# Altium schematic sheet supply.SchDoc: Supply and battery charger
size A3; Author: Pietro Lorefice; Address3: Firenze; Address4: ITALY; Revision: 0; SheetNumber: 1; SheetTotal: 2; License: GPLv3
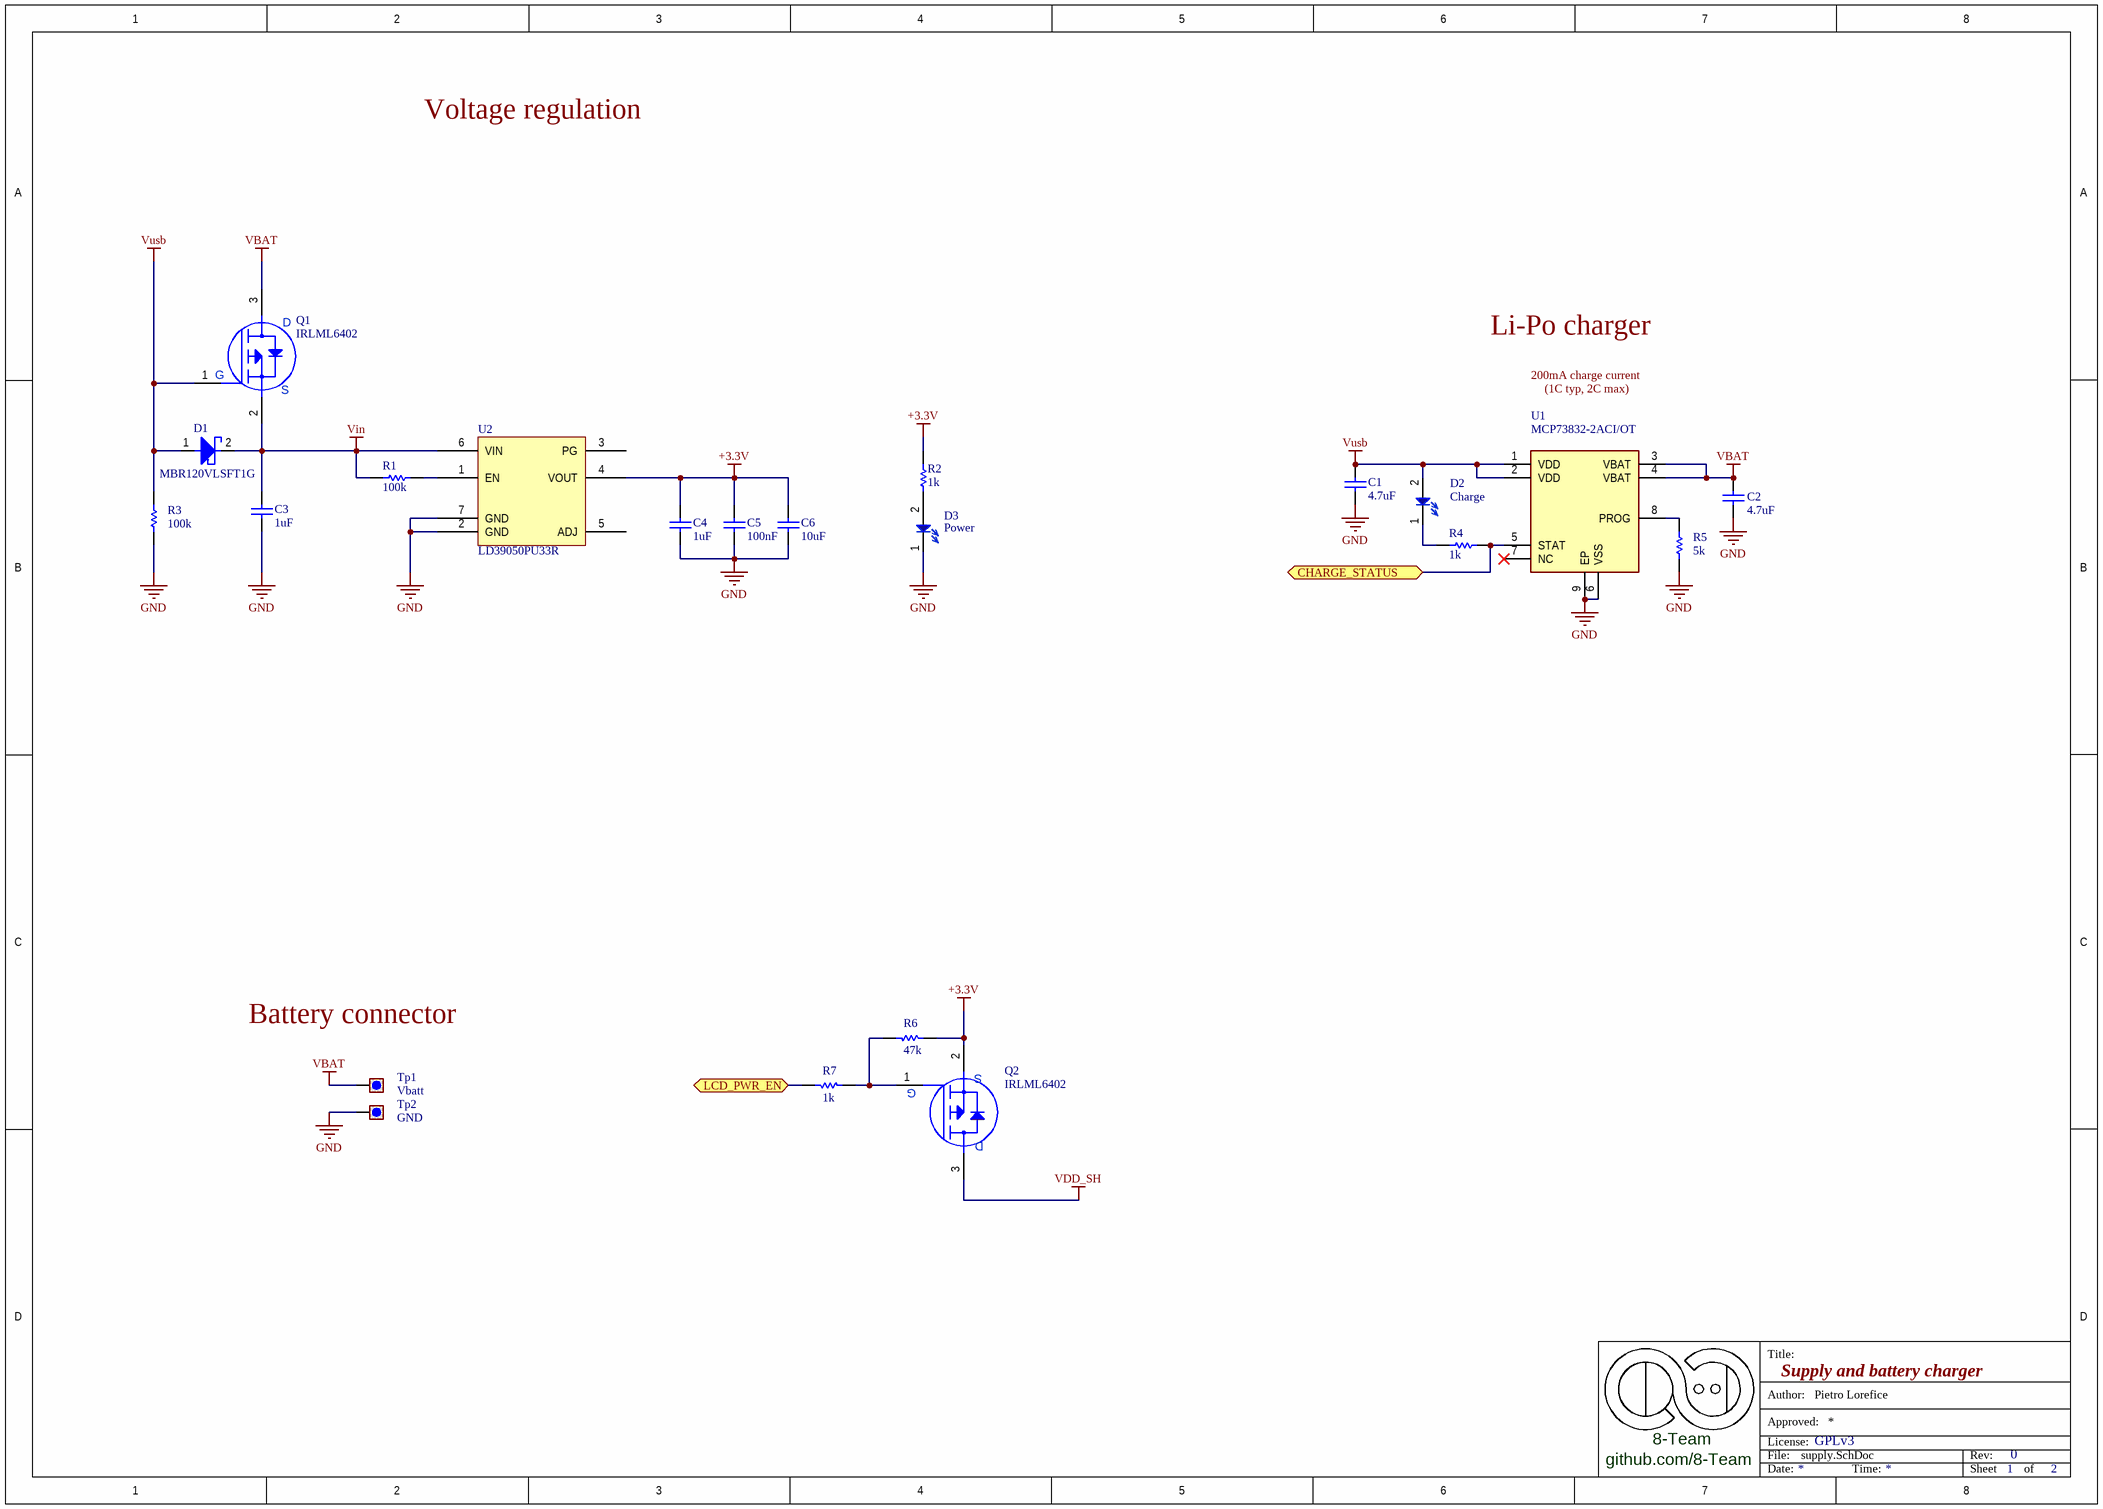
[diagram p0: supply.SchDoc]

## Parts
C1  4.7uF  [0603_[1608]]
C2  4.7uF  [0603_[1608]]
C3  1uF  [0603_[1608]]
C4  1uF  [0603_[1608]]
C5  100nF  [0402_[1005]]
C6  10uF  [0603_[1608]]
D1  MBR120VLSFT1G  [SOD-123]
D2  Charge  [0402_[1005]_K1-A2_LED]
D3  Power  [0402_[1005]_K1-A2_LED]
Q1  IRLML6402  [SOT-23]
Q2  IRLML6402  [SOT-23]
R1  100k  [0402_[1005]]
R2  1k  [0402_[1005]]
R3  100k  [0402_[1005]]
R4  1k  [0402_[1005]]
R5  5k  [0402_[1005]]
R6  47k  [0402_[1005]]
R7  1k  [0402_[1005]]
Tp1  Vbatt  [TEST_POINT_SMD_D1.6MM]  (no BOM)
Tp2  GND  [TEST_POINT_SMD_D1.6MM]  (no BOM)
U1  MCP73832-2ACI/OT  [PQFN50P200X300X100_HS-9N]
U2  LD39050PU33R  [DFN95P300X300X100_HS-7L]

## Ports
CHARGE_STATUS (bidir), LCD_PWR_EN (bidir)

## Nets
+3.3V: C4.2 C5.2 C6.2 Q2.2(S) R2.1 R6.1 U2.4(VOUT)
GND: C1.1 C2.1 C3.2 C4.1 C5.1 C6.1 D3.1(K) R3.1 R5.1 Tp2.1 U1.6(VSS) U1.9(EP) U2.2(GND) U2.7(GND)
VBAT: C2.2 Q1.3(D) Tp1.1 U1.3(VBAT) U1.4(VBAT)
VDD_SH: Q2.3(D)
Vin: C3.1 D1.2(K) Q1.2(S) R1.2 U2.6(VIN)
Vusb: C1.2 D1.1(A) D2.2(A) Q1.1(G) R3.2 U1.1(VDD) U1.2(VDD)
CHARGE_STATUS: R4.2 U1.5(STAT) ; port CHARGE_STATUS
LCD_PWR_EN: R7.2 ; port LCD_PWR_EN
NetD2_1: D2.1(K) R4.1
NetD3_2: D3.2(A) R2.2
NetQ2_1: Q2.1(G) R6.2 R7.1
NetR1_1: R1.1 U2.1(EN)
NetR5_2: R5.2 U1.8(PROG)

Not connected (* = marked no-connect by the designer): U1 7(NC)*; U2 3(PG) 5(ADJ)

## Notes on the sheet
- Voltage regulation
- Li-Po charger
- 200mA charge current
- (1C typ, 2C max)
- Battery connector
- Title:
- Author:
- 8-Team
- File:
- License:
- Approved:
- Rev:
- github.com/8-Team
- Date:
- Time:
- Sheet
- of

## Library data of the parts
C1-C4 C6 = Cap: Capacitor; Published: 8-Jun-2000; LatestRevisionDate: 17-Jul-2002; LatestRevisionNote: Re-released for DXP Platform.; PackageReference: RAD-0.3; Publisher: Altium Limited; PackageDescription: Radial Cap, Thru-Hole; 2 Leads; 0.3 in Pin Spacing
  C1 C2: Value: 4.7uF
  C3 C4: Value: 1uF
  C6: Value: 10uF
C5 = Cap: Capacitor; Value: 0.1uF; Published: 8-Jun-2000; LatestRevisionDate: 17-Jul-2002; LatestRevisionNote: Re-released for DXP Platform.; PackageReference: RAD-0.3; Publisher: Altium Limited; PackageDescription: Radial Cap, Thru-Hole; 2 Leads; 0.3 in Pin Spacing
D1 = Diode_SCHOTTKY: pin to pad: 1>2 2>1
D2 = LED_SMALL: Red
D3 = LED_SMALL: Green
Q1 Q2 = MOSFET-P 3pin
R1-R3 R7 = Res1: Resistor; Published: 8-Jun-2000; Publisher: Altium Limited
  R1 R3: LatestRevisionDate: 17-Jul-2002; LatestRevisionNote: Re-released for DXP Platform.; PackageReference: AXIAL-0.3; PackageDescription: Axial Device, Thru-Hole; 2 Leads; 0.3 in Pin Spacing; Value: 100K
  R2: LatestRevisionDate: 17-Jul-2002; LatestRevisionNote: Re-released for DXP Platform.; PackageReference: AXIAL-0.3; PackageDescription: Axial Device, Thru-Hole; 2 Leads; 0.3 in Pin Spacing; Value: 1K
  R7: Revision: July-2002: Re-released for DXP Platform.; Value: 1K
R4 = Res1: Resistor; Value: 470; Published: 8-Jun-2000; LatestRevisionDate: 17-Jul-2002; LatestRevisionNote: Re-released for DXP Platform.; PackageReference: AXIAL-0.3; Publisher: Altium Limited; PackageDescription: Axial Device, Thru-Hole; 2 Leads; 0.3 in Pin Spacing
R5 = Res1: Resistor; Value: 2K; Published: 8-Jun-2000; LatestRevisionDate: 17-Jul-2002; LatestRevisionNote: Re-released for DXP Platform.; PackageReference: AXIAL-0.3; Publisher: Altium Limited; PackageDescription: Axial Device, Thru-Hole; 2 Leads; 0.3 in Pin Spacing
R6 = Res1: Resistor; Value: 1K; Published: 8-Jun-2000; Revision: July-2002: Re-released for DXP Platform.; Publisher: Altium Limited
Tp1 Tp2 = Test_point
U1 = MCP7383x_DFN: Miniature Single-Cell, Fully Integrated Li-Ion, Li-Po Charge Management Controller
U2 = LD39050: 500mA low quiescent current and low noise voltage regulator